# Altium schematic sheet power2pix_leakmodule_v2.SchDoc
size A4
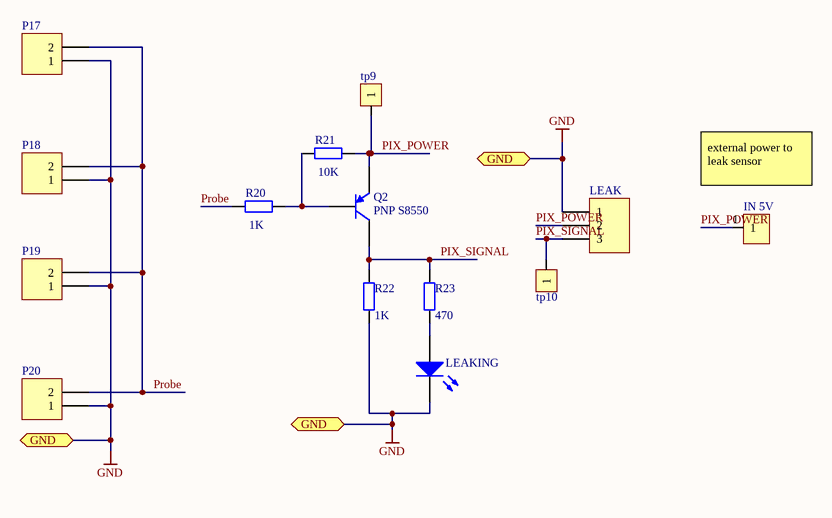
[diagram p0: power2pix_leakmodule_v2.SchDoc]

## Parts
IN_5V  connector1  [connector1]  (value not drawn)
LEAK  Header 3  [HDR1X3]  (value not drawn)
LEAKING  LED0  [6-0805_L]  (value not drawn)
P17  Header 2  [headerX2]  (value not drawn)
P18  Header 2  [headerX2]  (value not drawn)
P19  Header 2  [headerX2]  (value not drawn)
P20  Header 2  [headerX2]  (value not drawn)
Q2  PNP S8550  [SOT89L]
R20  value 1K  [6-0805_L]  (hidden comment: Res2)
R21  value 10K  [6-0805_L]  (hidden comment: Res2)
R22  value 1K  [6-0805_L]  (hidden comment: Res2)
R23  value 470  [6-0805_L]  (hidden comment: Res2)
tp9  tp  [TestPoint]  (value not drawn)
tp10  tp  [TestPoint]  (value not drawn)

## Ports
GND

## Nets
GND: LEAK.1 LEAKING.2(K) P17.1 P18.1 P19.1 P20.1 R22.2 ; port GND
PIX_POWER: IN_5V.1 LEAK.2 Q2.3(E) R21.1 tp9.1
PIX_SIGNAL: LEAK.3 Q2.2(C) R22.1 R23.2 tp10.1
Probe: P17.2 P18.2 P19.2 P20.2 R20.2
NetLEAKING_1: LEAKING.1(A) R23.1
NetQ2_1: Q2.1(B) R20.1 R21.2

## Notes on the sheet
- (near IN_5V) external power to leak sensor

## Library data of the parts
LEAK = Header 3: Header, 3-Pin; LatestRevisionDate: 17-Jul-2002; LatestRevisionNote: Re-released for DXP Platform.; Publisher: Altium Limited
LEAKING = LED0: Typical INFRARED GaAs LED; Published: 8-Jun-2000; LatestRevisionDate: 08-Jul-2005; LatestRevisionNote: Mech Layer 1 removed.; PackageReference: LED-0; Publisher: Altium Limited; PackageDescription: LED; 2 Leads
P17-P20 = Header 2: Header, 2-Pin; LatestRevisionDate: 17-Jul-2002; LatestRevisionNote: Re-released for DXP Platform.; Publisher: Altium Limited
Q2 = PNP: PNP Bipolar Transistor; Published: 8-Jun-2000; LatestRevisionDate: 29-May-2009; LatestRevisionNote: IPC-7351 Footprint Added.; PackageVersion: Aug-1999; PackageReference: SOT-23B; Publisher: Altium Limited; PackageDescription: 3-Pin SOT-23 Package 0.95 mm Pitch, 2.4 mm Lead Span
R20-R23 = Res2: Resistor; Published: 8-Jun-2000; LatestRevisionDate: 17-Jul-2002; LatestRevisionNote: Re-released for DXP Platform.; PackageReference: AXIAL-0.4; Publisher: Altium Limited; PackageDescription: Axial Device, Thru-Hole; 2 Leads; 0.4 in Pin Spacing